# Altium schematic sheet dds.SchDoc: 9833 Synth
size A3; Organization: Altium Limited; Address1: L3, 12a Rodborough Rd; Address2: Frenchs Forest; Address3: NSW; Address4: Australia 2086
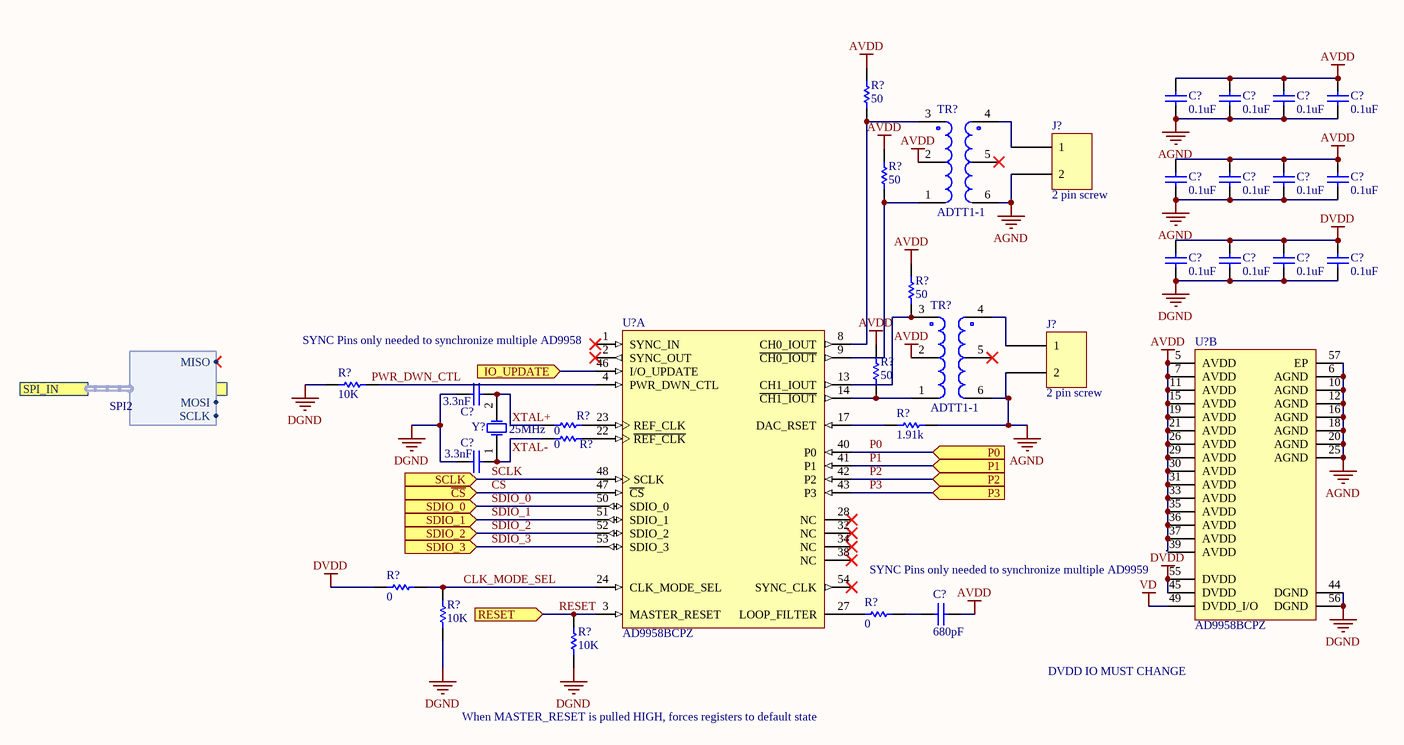
[diagram p0: dds.SchDoc]

## Parts
(Parts that share a designator on the sheet are numbered #1, #2 ... from top to bottom, then left to right.)
C?#1  0.1uF  [0402]
C?#2  0.1uF  [0402]
C?#3  0.1uF  [0402]
C?#4  0.1uF  [0402]
C?#5  0.1uF  [0402]
C?#6  0.1uF  [0402]
C?#7  0.1uF  [0402]
C?#8  0.1uF  [0402]
C?#9  0.1uF  [0402]
C?#10  0.1uF  [0402]
C?#11  0.1uF  [0402]
C?#12  0.1uF  [0402]
C?#13  3.3nF  [0402]
C?#14  3.3nF  [0402]
C?#15  680pF  [0402]
J?#1  2 pin screw  [CUI_TB003-500-P02BE]
J?#2  2 pin screw  [CUI_TB003-500-P02BE]
R?#1  50  [0402]
R?#2  50  [0402]
R?#3  50  [0402]
R?#4  10K  [0402]
R?#5  50  [0402]
R?#6  0  [0402]
R?#7  1.91k  [0402]
R?#8  0  [0402]
R?#9  0  [0402]
R?#10  0  [0402]
R?#11  10K  [0402]
R?#12  10K  [0402]
TR?#1  ADTT1-1  [ADTT]
TR?#2  ADTT1-1  [ADTT]
U?#1  AD9958BCPZ  [ADI-CP-56-1_N]  (part A of 2)
U?#2  AD9958BCPZ  [ADI-CP-56-1_N]  (part B of 2)
Y?  25MHz  [XTAL_ECS-160-20-4X]

## Ports
CS (in), IO_UPDATE (in), P0 (in), P1 (in), P2 (in), P3 (in), RESET (in), SCLK (in), SDIO_0 (in), SDIO_1 (in), SDIO_2 (in), SDIO_3 (in), SPI_IN (harness SPI2), ~{CS} (in)

## Harnesses
SPI2: MOSI, MISO, SCLK

## Nets
AGND: C?#1.1 C?#2.1 C?#3.1 C?#4.1 C?#5.1 C?#6.1 C?#7.1 C?#8.1 J?#1.2 J?#2.2 R?#7.2 TR?#1.6(SEC-) TR?#2.6(SEC-) U?#2.6(AGND) U?#2.10(AGND) U?#2.12(AGND) U?#2.16(AGND) U?#2.18(AGND) U?#2.20(AGND) U?#2.25(AGND) U?#2.57(EP)
AVDD: C?#1.2 C?#2.2 C?#3.2 C?#4.2 C?#5.2 C?#6.2 C?#7.2 C?#8.2 C?#15.2 R?#1.2 R?#2.2 R?#3.2 R?#5.2 TR?#1.2(PRI0) TR?#2.2(PRI0) U?#2.5(AVDD) U?#2.7(AVDD) U?#2.11(AVDD) U?#2.15(AVDD) U?#2.19(AVDD) U?#2.21(AVDD) U?#2.26(AVDD) U?#2.29(AVDD) U?#2.30(AVDD) U?#2.31(AVDD) U?#2.33(AVDD) U?#2.35(AVDD) U?#2.36(AVDD) U?#2.37(AVDD)
DGND: C?#9.1 C?#10.1 C?#11.1 C?#12.1 C?#13.2 C?#14.2 R?#4.1 R?#11.1 R?#12.1 U?#2.44(DGND) U?#2.56(DGND)
DVDD: C?#9.2 C?#10.2 C?#11.2 C?#12.2 R?#9.1 U?#2.45(DVDD) U?#2.55(DVDD)
VD: U?#2.49(DVDD_I/O)
~{CS}: U?#1.47(~{CS}) ; port ~{CS}
CLK_MODE_SEL: R?#9.2 R?#11.2 U?#1.24(CLK_MODE_SEL)
IO_UPDATE: U?#1.46(I/O_UPDATE) ; port IO_UPDATE
P0: U?#1.40(P0) ; port P0
P1: U?#1.41(P1) ; port P1
P2: U?#1.42(P2) ; port P2
P3: U?#1.43(P3) ; port P3
RESET: R?#12.2 U?#1.3(MASTER_RESET) ; port RESET
SCLK: U?#1.48(SCLK) ; port SCLK
SDIO_0: U?#1.50(SDIO_0) ; port SDIO_0
SDIO_1: U?#1.51(SDIO_1) ; port SDIO_1
SDIO_2: U?#1.52(SDIO_2) ; port SDIO_2
SDIO_3: U?#1.53(SDIO_3) ; port SDIO_3
XTAL+: C?#13.1 R?#6.1 Y?.2(OSC2)
XTAL-: C?#14.1 R?#8.1 Y?.1(OSC1)
NetC?#15_1: C?#15.1 R?#10.2
NetJ?#1_1: J?#1.1 TR?#1.4(SEC+)
NetJ?#2_1: J?#2.1 TR?#2.4(SEC+)
NetR?#1_1: R?#1.1 TR?#1.3(PRI+) U?#1.8(CH0_IOUT)
NetR?#2_1: R?#2.1 TR?#1.1(PRI-) U?#1.9(~{CH0_IOUT})
NetR?#3_1: R?#3.1 TR?#2.3(PRI+) U?#1.13(CH1_IOUT)
NetR?#4_2: R?#4.2 U?#1.4(PWR_DWN_CTL)
NetR?#5_1: R?#5.1 TR?#2.1(PRI-) U?#1.14(~{CH1_IOUT})
NetR?#6_2: R?#6.2 U?#1.23(REF_CLK)
NetR?#7_1: R?#7.1 U?#1.17(DAC_RSET)
NetR?#8_2: R?#8.2 U?#1.22(~{REF_CLK})
NetR?#10_1: R?#10.1 U?#1.27(LOOP_FILTER)

Not connected (* = marked no-connect by the designer): TR?#1 5(SEC0)*; TR?#2 5(SEC0)*; U?#1 1(SYNC_IN)* 2(SYNC_OUT)* 28(NC)* 32(NC)* 34(NC)* 38(NC)* 54(SYNC_CLK)*; U?#2 39(AVDD)

## Notes on the sheet
- (near U?#1) SYNC Pins only needed to synchronize multiple AD9958
- (near U?#2) SYNC Pins only needed to synchronize multiple AD9959
- DVDD IO MUST CHANGE
- When MASTER_RESET is pulled HIGH, forces registers to default state
- Labels drawn without touching a wire or pin: PWR_DWN_CTL
- Title
- Date:
- RE:
- Arturo di Girolamo
- Size:
- A3
- A

## Library data of the parts
C?#1-C?#12 = CL21B104KACNNNC: Capacitor, 0.1uF, 0805; Value: .01uf; MFGPN: CL21B104KACNNNC
C?#13 C?#14 = C0805C332KARACAUTO: Capacitor, 3.3nF, 0805; Value: .01uf; MFGPN: C0805C332KARACAUTO
C?#15 = GRM21BR61E226ME44L: Capacitor, 22uF, 0805, 25V; Value: .01uf; MFGPN: GRM21BR61E226ME44L
R?#1-R?#3 R?#5 R?#7 = RMCF0805ZT0R00: 0 ohm jumper; Value: 0; MFGPN: RMCF0805ZT0R00
R?#4 R?#11 R?#12 = RNCP0805FTD10K0: 10K 1% 1/4W; Value: 1K; MFGPN: RNCP0805FTD10K0
R?#6 R?#8-R?#10 = RMCF0805ZT0R00: 0 ohm jumper; Value: 0; MFGPN: RMCF0805ZT0R00
TR?#1 TR?#2 = ADTT1-1: Xfmr, Isolation, 50 ohm, 1: 1, 0.3-300 MHz, SMT; MP: ADTT1-1+; MF: Mini-Circuits; Package: None; Availability: Unavailable; SnapEDA_Link: https://www.snapeda.com/parts/ADTT1-1%2B/Mini-Circuits/view-part/923578/?ref=snap; Price: None; Value: *
U?#1 U?#2 = CMP-0293-00007-1: 2-Channel, 500 MSPS DDS with 10-Bit DACs, Serial, CP-56-1, 260 Tray, Pb-Free; I Supply total (max): 105mA; Tuning Word Width (bits): 32bit; Master fclk: 500MHz; Resolution (Bits): 10bit; FS Iout (mA nom): 10mA; Compliance Range (V): 2.3V; REFCLK Multiplier: Yes; PackageVersion: 112805-0; I/O Interface: Serial; ComponentLink2Description: Datasheet; ComponentLink1Description: Manufacturer URL; ComponentLink1URL: www.analog.com; PackageDescription: 56-Lead Lead Frame Chip Scale Package [LFCSP_VQ]; ComponentLink2URL: http://www.analog.com/static/imported-files/data_sheets/AD9958.pdf; ComponentLink3URL: http://www.analog.com/static/imported-files/packages/32698137492825CP_56_1.pdf; PackageReference: CP-56-1; Code_JEDEC: MO-220-VLLD-2; DatasheetVersion: Rev. A; ComponentLink3Description: Package Specification
Y? = XTAL: Crystal Oscillator; Published: 8-Jun-2000; LatestRevisionDate: 17-Jul-2002; LatestRevisionNote: Re-released for DXP Platform.; PackageReference: R38; Publisher: Altium Limited; PackageDescription: Crystal, Thru-Hole; 2 Leads; Body 3.1 x 8.2 mm (Dia.xH)